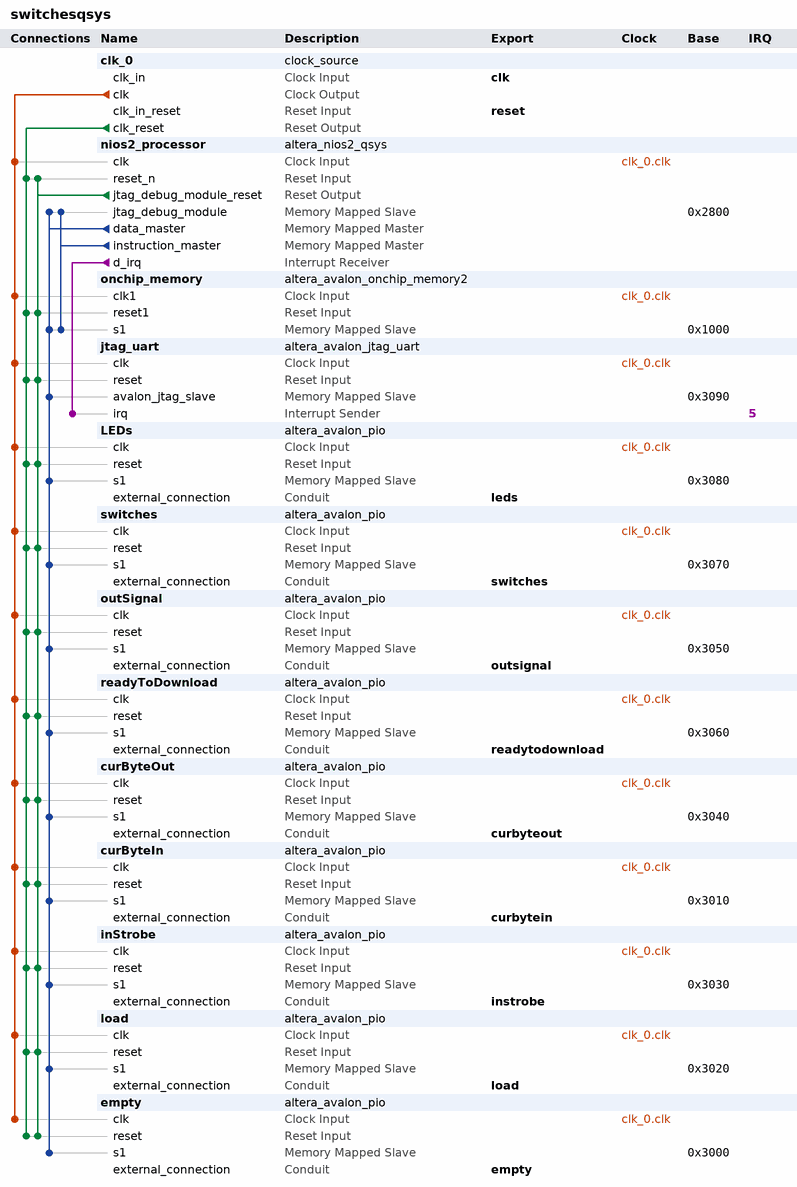
[diagram p0: system contents]
# Platform Designer (Qsys) system switchesqsys, Cyclone V 5CSEMA5F31C6
# Parameters at their usual value, and those the tool derives, are not listed.
package require -exact qsys 14.0
create_system switchesqsys
set_project_property DEVICE_FAMILY {Cyclone V}
set_project_property DEVICE 5CSEMA5F31C6

add_instance clk_0 clock_source 14.0
set_instance_parameter_value clk_0 clockFrequency 50000000

add_instance nios2_processor altera_nios2_qsys 14.0
set_instance_parameter_value nios2_processor resetrequest_enabled true
set_instance_parameter_value nios2_processor resetSlave onchip_memory.s1
set_instance_parameter_value nios2_processor mmu_TLBMissExcSlave None
set_instance_parameter_value nios2_processor exceptionSlave onchip_memory.s1
set_instance_parameter_value nios2_processor breakSlave nios2_processor.jtag_debug_module
set_instance_parameter_value nios2_processor impl Tiny
set_instance_parameter_value nios2_processor icache_size 4096

add_instance onchip_memory altera_avalon_onchip_memory2 14.0
set_instance_parameter_value onchip_memory dataWidth 32
set_instance_parameter_value onchip_memory dualPort false
set_instance_parameter_value onchip_memory initMemContent true
set_instance_parameter_value onchip_memory initializationFileName onchip_mem.hex
set_instance_parameter_value onchip_memory memorySize 4096

add_instance jtag_uart altera_avalon_jtag_uart 14.0
set_instance_parameter_value jtag_uart simInteractiveOptions NO_INTERACTIVE_WINDOWS

add_instance LEDs altera_avalon_pio 14.0
set_instance_parameter_value LEDs direction Output
set_instance_parameter_value LEDs width 8

add_instance switches altera_avalon_pio 14.0
set_instance_parameter_value switches direction Input
set_instance_parameter_value switches width 8

add_instance outSignal altera_avalon_pio 14.0
set_instance_parameter_value outSignal direction Output
set_instance_parameter_value outSignal width 2

add_instance readyToDownload altera_avalon_pio 14.0
set_instance_parameter_value readyToDownload direction Input
set_instance_parameter_value readyToDownload width 1

add_instance curByteOut altera_avalon_pio 14.0
set_instance_parameter_value curByteOut direction Output
set_instance_parameter_value curByteOut width 8

add_instance curByteIn altera_avalon_pio 14.0
set_instance_parameter_value curByteIn direction Input
set_instance_parameter_value curByteIn width 8

add_instance inStrobe altera_avalon_pio 14.0
set_instance_parameter_value inStrobe direction Input
set_instance_parameter_value inStrobe width 1

add_instance load altera_avalon_pio 14.0
set_instance_parameter_value load direction Output
set_instance_parameter_value load width 1

add_instance empty altera_avalon_pio 14.0
set_instance_parameter_value empty direction Input
set_instance_parameter_value empty width 1

# connections
add_connection clk_0.clk curByteIn.clk clock
add_connection clk_0.clk curByteOut.clk clock
add_connection clk_0.clk empty.clk clock
add_connection clk_0.clk inStrobe.clk clock
add_connection clk_0.clk jtag_uart.clk clock
add_connection clk_0.clk LEDs.clk clock
add_connection clk_0.clk load.clk clock
add_connection clk_0.clk nios2_processor.clk clock
add_connection clk_0.clk onchip_memory.clk1 clock
add_connection clk_0.clk outSignal.clk clock
add_connection clk_0.clk readyToDownload.clk clock
add_connection clk_0.clk switches.clk clock
add_connection clk_0.clk_reset curByteIn.reset reset
add_connection clk_0.clk_reset curByteOut.reset reset
add_connection clk_0.clk_reset empty.reset reset
add_connection clk_0.clk_reset inStrobe.reset reset
add_connection clk_0.clk_reset jtag_uart.reset reset
add_connection clk_0.clk_reset LEDs.reset reset
add_connection clk_0.clk_reset load.reset reset
add_connection clk_0.clk_reset nios2_processor.reset_n reset
add_connection clk_0.clk_reset onchip_memory.reset1 reset
add_connection clk_0.clk_reset outSignal.reset reset
add_connection clk_0.clk_reset readyToDownload.reset reset
add_connection clk_0.clk_reset switches.reset reset
add_connection nios2_processor.jtag_debug_module_reset curByteIn.reset reset
add_connection nios2_processor.jtag_debug_module_reset curByteOut.reset reset
add_connection nios2_processor.jtag_debug_module_reset empty.reset reset
add_connection nios2_processor.jtag_debug_module_reset inStrobe.reset reset
add_connection nios2_processor.jtag_debug_module_reset jtag_uart.reset reset
add_connection nios2_processor.jtag_debug_module_reset LEDs.reset reset
add_connection nios2_processor.jtag_debug_module_reset load.reset reset
add_connection nios2_processor.jtag_debug_module_reset nios2_processor.reset_n reset
add_connection nios2_processor.jtag_debug_module_reset onchip_memory.reset1 reset
add_connection nios2_processor.jtag_debug_module_reset outSignal.reset reset
add_connection nios2_processor.jtag_debug_module_reset readyToDownload.reset reset
add_connection nios2_processor.jtag_debug_module_reset switches.reset reset
add_connection nios2_processor.data_master curByteIn.s1 avalon
set_connection_parameter_value nios2_processor.data_master/curByteIn.s1 baseAddress 0x3010
add_connection nios2_processor.data_master curByteOut.s1 avalon
set_connection_parameter_value nios2_processor.data_master/curByteOut.s1 baseAddress 0x3040
add_connection nios2_processor.data_master empty.s1 avalon
set_connection_parameter_value nios2_processor.data_master/empty.s1 baseAddress 0x3000
add_connection nios2_processor.data_master inStrobe.s1 avalon
set_connection_parameter_value nios2_processor.data_master/inStrobe.s1 baseAddress 0x3030
add_connection nios2_processor.data_master jtag_uart.avalon_jtag_slave avalon
set_connection_parameter_value nios2_processor.data_master/jtag_uart.avalon_jtag_slave baseAddress 0x3090
add_connection nios2_processor.data_master LEDs.s1 avalon
set_connection_parameter_value nios2_processor.data_master/LEDs.s1 baseAddress 0x3080
add_connection nios2_processor.data_master load.s1 avalon
set_connection_parameter_value nios2_processor.data_master/load.s1 baseAddress 0x3020
add_connection nios2_processor.data_master nios2_processor.jtag_debug_module avalon
set_connection_parameter_value nios2_processor.data_master/nios2_processor.jtag_debug_module baseAddress 0x2800
add_connection nios2_processor.data_master onchip_memory.s1 avalon
set_connection_parameter_value nios2_processor.data_master/onchip_memory.s1 baseAddress 0x1000
add_connection nios2_processor.data_master outSignal.s1 avalon
set_connection_parameter_value nios2_processor.data_master/outSignal.s1 baseAddress 0x3050
add_connection nios2_processor.data_master readyToDownload.s1 avalon
set_connection_parameter_value nios2_processor.data_master/readyToDownload.s1 baseAddress 0x3060
add_connection nios2_processor.data_master switches.s1 avalon
set_connection_parameter_value nios2_processor.data_master/switches.s1 baseAddress 0x3070
add_connection nios2_processor.instruction_master nios2_processor.jtag_debug_module avalon
set_connection_parameter_value nios2_processor.instruction_master/nios2_processor.jtag_debug_module baseAddress 0x2800
add_connection nios2_processor.instruction_master onchip_memory.s1 avalon
set_connection_parameter_value nios2_processor.instruction_master/onchip_memory.s1 baseAddress 0x1000
add_connection nios2_processor.d_irq jtag_uart.irq interrupt
set_connection_parameter_value nios2_processor.d_irq/jtag_uart.irq irqNumber 5

# exported interfaces
add_interface clk clock sink
set_interface_property clk EXPORT_OF clk_0.clk_in
add_interface reset reset sink
set_interface_property reset EXPORT_OF clk_0.clk_in_reset
add_interface switches conduit end
set_interface_property switches EXPORT_OF switches.external_connection
add_interface leds conduit end
set_interface_property leds EXPORT_OF LEDs.external_connection
add_interface readytodownload conduit end
set_interface_property readytodownload EXPORT_OF readyToDownload.external_connection
add_interface outsignal conduit end
set_interface_property outsignal EXPORT_OF outSignal.external_connection
add_interface curbyteout conduit end
set_interface_property curbyteout EXPORT_OF curByteOut.external_connection
add_interface instrobe conduit end
set_interface_property instrobe EXPORT_OF inStrobe.external_connection
add_interface load conduit end
set_interface_property load EXPORT_OF load.external_connection
add_interface curbytein conduit end
set_interface_property curbytein EXPORT_OF curByteIn.external_connection
add_interface empty conduit end
set_interface_property empty EXPORT_OF empty.external_connection

set_interconnect_requirement {$system} qsys_mm.clockCrossingAdapter HANDSHAKE
set_interconnect_requirement {$system} qsys_mm.maxAdditionalLatency 1
set_interconnect_requirement {$system} qsys_mm.insertDefaultSlave FALSE

save_system switchesqsys.qsys
